# Altium schematic sheet microSDHC_SPI.SchDoc
size A4
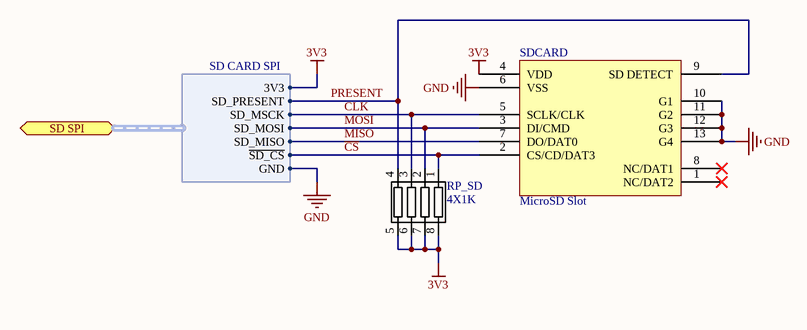
[diagram p0: microSDHC_SPI.SchDoc]

## Parts
RP_SD  4X1K  [1206-ARRAY-4]
SDCARD  MicroSD Slot  [MICROSD Slot]

## Ports
SD SPI (harness SD CARD SPI)

## Harnesses
SD CARD SPI: ~{SD_CS}, SD_MOSI, SD_MISO, SD_MSCK, SD_PRESENT, GND, 3V3

## Nets
3V3: RP_SD.5 RP_SD.6 RP_SD.7 RP_SD.8 SDCARD.4(VDD) ; port SD SPI.3V3
GND: SDCARD.6(VSS) SDCARD.10(G1) SDCARD.11(G2) SDCARD.12(G3) SDCARD.13(G4) ; port SD SPI.GND
~{CS}: RP_SD.1 SDCARD.2(CS/CD/DAT3) ; port SD SPI.~{SD_CS}
CLK: RP_SD.3 SDCARD.5(SCLK/CLK) ; port SD SPI.SD_MSCK
MISO: SDCARD.7(DO/DAT0) ; port SD SPI.SD_MISO
MOSI: RP_SD.2 SDCARD.3(DI/CMD) ; port SD SPI.SD_MOSI
PRESENT: RP_SD.4 SDCARD.9(SD_DETECT) ; port SD SPI.SD_PRESENT

Not connected (* = marked no-connect by the designer): SDCARD 1(NC/DAT2)* 8(NC/DAT1)*

## Library data of the parts
RP_SD = ARRAY4-100R-ROHM: GENERIC RESISTOR ARRAY 4X INDEPENDENT; Manufacturer Part Number: MNR14E0APJ101; Manufacturer: Rohm Semiconductor; Power Per Element: 62.5mW; Tolerance: ±5%; Number of Resistors: 4; Circuit Type: Isolated; Resistance In Ohms: 100; Temperature Coefficient: ±200ppm/°C; Reel: RA1; Supplier 1: Digi-Key; Category: Resistors; Number of Pins: 8; Mounting Type: Surface Mount; Supplier: Digi-Key; Package / Case: 0603 x 4 Convex (1608 metric); Packaging: Tape & Reel (TR); RoHS: RoHS Compliant; Supplier Part Number 1: MNR14101RTR-ND; Supplier Part Number: MNR14101RTR-ND